# EAGLE schematic MCU_Power_PCB_Rev1 (EAGLE 9.6.2)
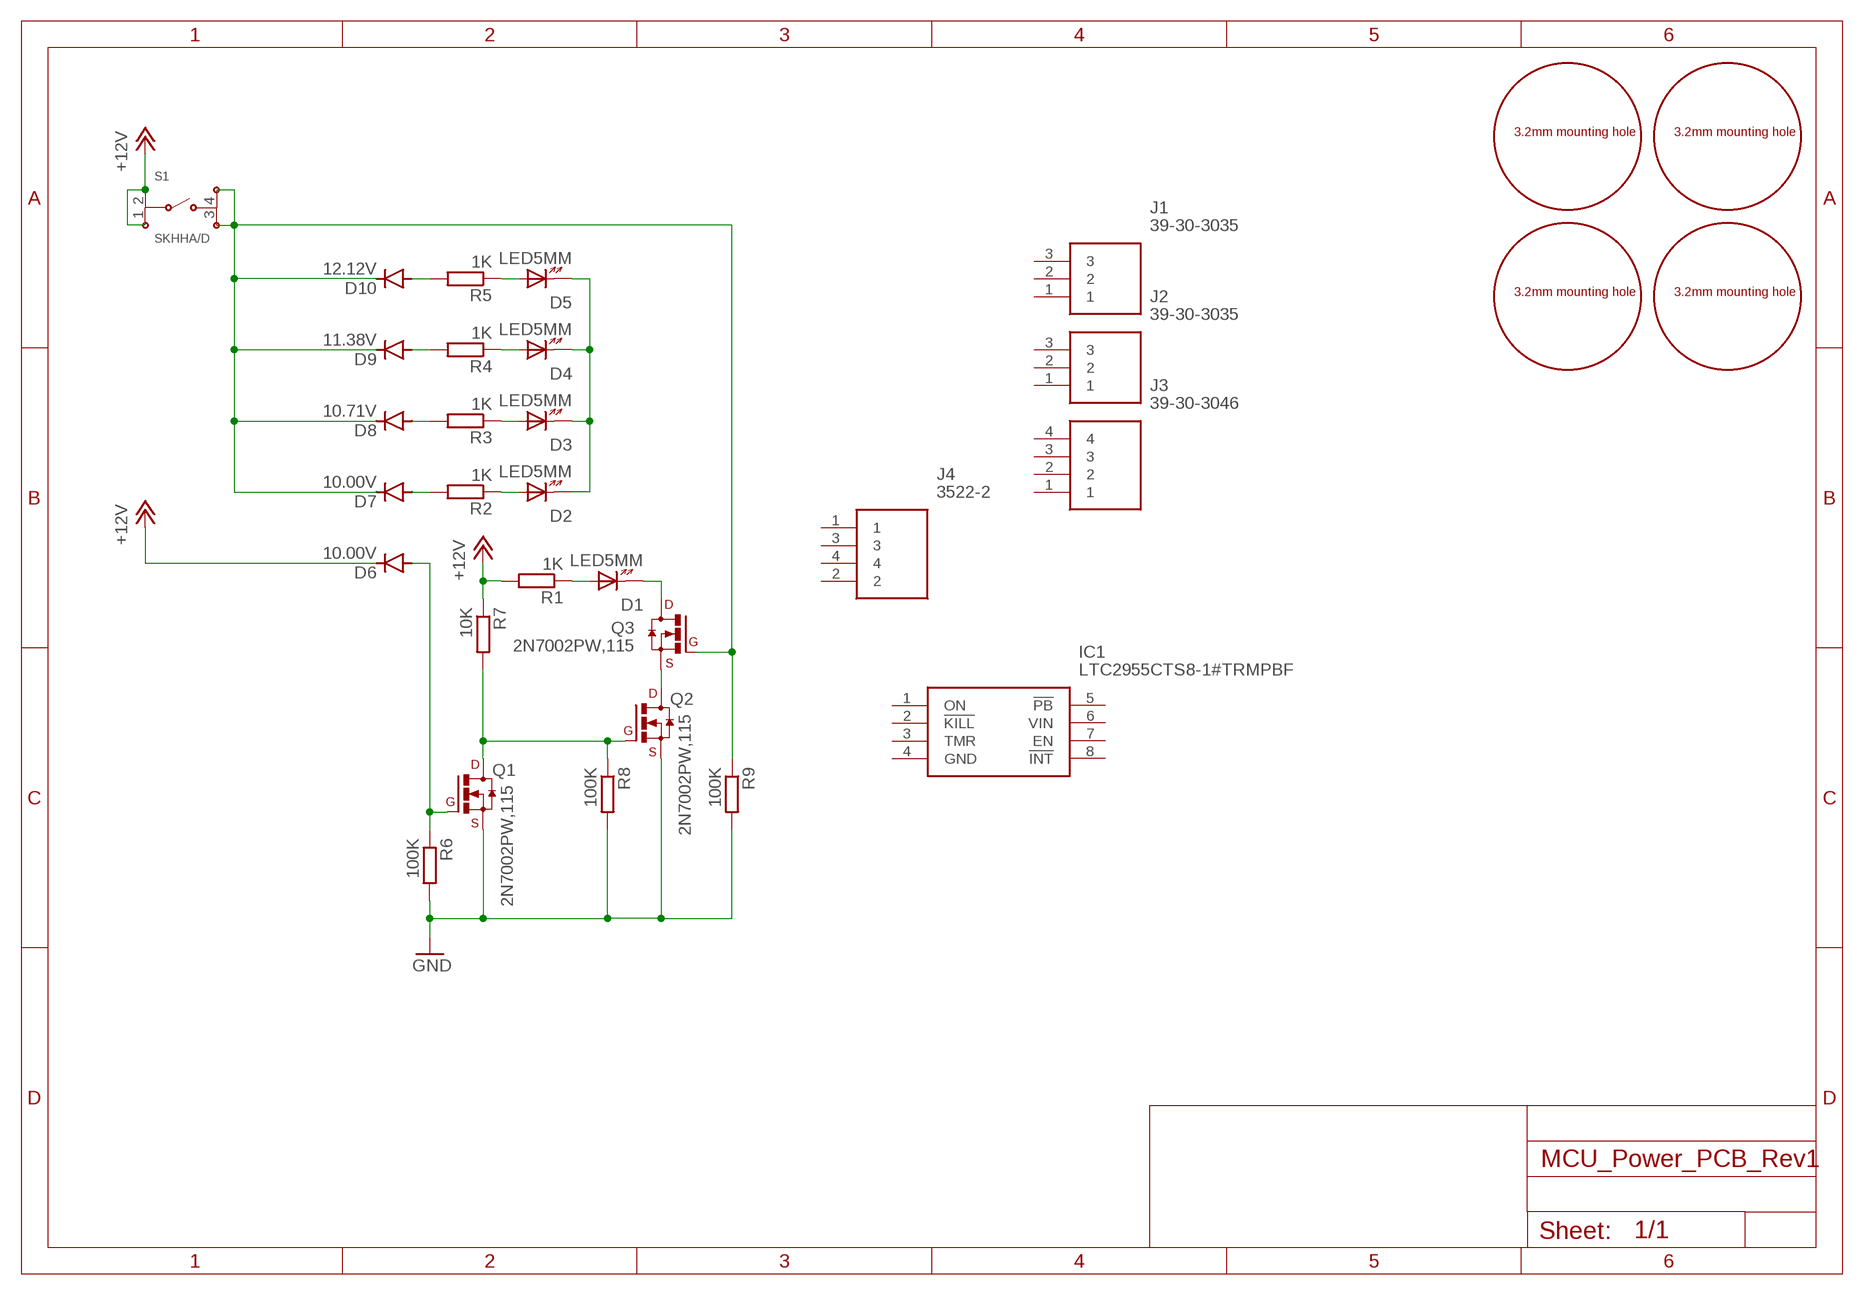
[diagram p0: schematic, sheet 1]

## Parts
D1  LED5MM  [LED5MM]
D2  LED5MM  [LED5MM]
D3  LED5MM  [LED5MM]
D4  LED5MM  [LED5MM]
D5  LED5MM  [LED5MM]
D6  10.00V  CGRM4001-G  [SOD-123_MINI-SMA]
D7  10.00V  CGRM4001-G  [SOD-123_MINI-SMA]
D8  10.71V  CGRM4001-G  [SOD-123_MINI-SMA]
D9  11.38V  CGRM4001-G  [SOD-123_MINI-SMA]
D10  12.12V  CGRM4001-G  [SOD-123_MINI-SMA]
HOLE1  M3_MOUNTING_HOLE  [M3_MOUNTING_HOLE]
HOLE2  M3_MOUNTING_HOLE  [M3_MOUNTING_HOLE]
HOLE3  M3_MOUNTING_HOLE  [M3_MOUNTING_HOLE]
HOLE4  M3_MOUNTING_HOLE  [M3_MOUNTING_HOLE]
IC1  LTC2955CTS8-1#TRMPBF  [SOT65P280X100-8N]
J1  39-30-3035  [39303035]
J2  39-30-3035  [39303035]
J3  39-30-3046  [39303046]
J4  3522-2  [35222]
Q1  2N7002PW,115  [SOT323]
Q2  2N7002PW,115  [SOT323]
Q3  2N7002PW,115  [SOT323]
R1  1K  R0603  [R0603]
R2  1K  R0603  [R0603]
R3  1K  R0603  [R0603]
R4  1K  R0603  [R0603]
R5  1K  R0603  [R0603]
R6  100K  R0603  [R0603]
R7  10K  R0603  [R0603]
R8  100K  R0603  [R0603]
R9  100K  R0603  [R0603]
S1  SKHHA/D  [SKHHA/D]

## Nets
+12V: D6.C R1.2 R7.1 S1.1 S1.2
GND: Q1.2(S) Q2.2(S) R6.2 R8.2 R9.2
N$1: D6.A Q1.1(G) R6.1
N$2: D1.A R1.1
N$3: D2.A R2.1
N$4: D7.A R2.2
N$5: D8.A R3.2
N$6: D9.A R4.2
N$7: D10.A R5.2
N$8: D3.A R3.1
N$9: D4.A R4.1
N$10: D5.A R5.1
N$11: Q1.3(D) Q2.1(G) R7.2 R8.1
N$12: D1.K Q3.3(D)
N$13: D2.K D3.K D4.K D5.K
N$15: Q2.3(D) Q3.2(S)
N$16: D7.C D8.C D9.C D10.C Q3.1(G) R9.1 S1.3 S1.4
Unconnected: IC1.1(ON) IC1.2(!KILL) IC1.3(TMR) IC1.5(!PB) IC1.6(VIN) IC1.7(EN) IC1.8(!INT) J1.1 J1.2 J1.3 J2.1 J2.2 J2.3 J3.1 J3.2 J3.3 J3.4 J4.1 J4.2 J4.3 J4.4

## Power pins joined to a net without a drawn wire
GND: IC1.4(GND)

## Library data of the parts
D1-D5 = CASE-LED:LED5MM: LED 5mm (TH) Description: Standard 5mm TH LED
D6-D10 = diode:CGRM400*-G: Molded plasitc,JEDEC SOD-123/Mini SMA Source: Comchip CGRM4001-G.pdf
HOLE1-HOLE4 = RescueRunner:M3_MOUNTING_HOLE
IC1 = LTC2955CTS8-1#TRMPBF:LTC2955CTS8-1#TRMPBF: LTC2955CTS8-1#TRMPBF, Voltage Controller 0.76V Push Button Controller 8-Pin TSOT-23 Source: Datasheet <http://uk.rs-online.com/web/p/products/8226837P>; DESCRIPTION: LTC2955CTS8-1#TRMPBF, Voltage Controller 0.76V Push Button Controller 8-Pin TSOT-23; HEIGHT: 1mm; MANUFACTURER_NAME: Linear Technology; MANUFACTURER_PART_NUMBER: LTC2955CTS8-1#TRMPBF; RS_PART_NUMBER: 8226837P; RS_PRICE-STOCK: http://uk.rs-online.com/web/p/products/8226837P
J1 J2 = 39-30-3035:39-30-3035: Molex Mini-Fit Jr 5569, 3 Way, 1 Row, Right Angle PCB Header Source: Datasheet <http://uk.rs-online.com/web/p/products/6705849P>; ALLIED_NUMBER: 70266945; DESCRIPTION: Molex Mini-Fit Jr 5569, 3 Way, 1 Row, Right Angle PCB Header; HEIGHT: 5.8mm; MANUFACTURER_NAME: Molex; MANUFACTURER_PART_NUMBER: 39-30-3035; RS_PART_NUMBER: 6705849P; RS_PRICE-STOCK: http://uk.rs-online.com/web/p/products/6705849P
J3 = 39-30-3046:39-30-3046: Molex MINI-FIT JR. Series, Series Number 5569, 4.2mm Pitch 4 Way 1 Row Right Angle PCB Header, Solder Termination, 12A Source: Datasheet <http://uk.rs-online.com/web/p/products/6705859P>; ALLIED_NUMBER: 70374137; DESCRIPTION: Molex MINI-FIT JR. Series, Series Number 5569, 4.2mm Pitch 4 Way 1 Row Right Angle PCB Header, Solder Termination, 12A; HEIGHT: 6.18mm; MANUFACTURER_NAME: Molex; MANUFACTURER_PART_NUMBER: 39-30-3046; RS_PART_NUMBER: 6705859P; RS_PRICE-STOCK: http://uk.rs-online.com/web/p/products/6705859P
J4 = 3522-2:3522-2: Double ATO 257 fuseholder,15A 500Vac Keystone 15A PCB Mount Fuse Holder for 5.2 x 0.64mm Automotive Fuse, 500 V ac Source: Datasheet <http://uk.rs-online.com/web/p/products/1676068>; ALLIED_NUMBER: 70181615; DESCRIPTION: Double ATO 257 fuseholder,15A 500Vac Keystone 15A PCB Mount Fuse Holder for 5.2 x 0.64mm Automotive Fuse, 500 V ac; HEIGHT: 8mm; MANUFACTURER_NAME: Keystone Electronics; MANUFACTURER_PART_NUMBER: 3522-2; RS_PART_NUMBER: 1676068; RS_PRICE-STOCK: http://uk.rs-online.com/web/p/products/1676068
Q1-Q3 = CASE-Transistors:2N7002PW,115: 2N7002PW,115 N-Channel Mosfet (SOT-323) Description: 2N7002PW,115 N-Channel Mosfet in a SOT-323 (SC-70) package Links: 2N7002PW,115 <http://www.farnell.com/datasheets/1760698.pdf?_ga=2.3009012.510093211.1546607516-411290609.1543318711>
R1-R9 = CASE-RCL:R0603: Standard Chip RESISTOR 0603 (1608 Metric) Description: Standard Chip RESISTOR 0603 (1608 Metric)
S1 = CASE-Switches:SKHHA/D: ALPS SKHHA/D Tactile SPST switches (DIP) Description: ALPS SKHHA/D Tactile SPST switches in DIP package. Links: SKHHAJA010 <http://www.farnell.com/datasheets/1685516.pdf?_ga=2.249631877.2071720333.1546461288-1112771566.1525371275> SKHHARA010 <http://www.farnell.com/datasheets/1685516.pdf?_ga=2.249631877.2071720333.1546461288-1112771566.1525371275> SKHHAPA010 <http://www.farnell.com/datasheets/1582298.pdf?_ga=2.236523650.2071720333.1546461288-1112771566.1525371275> SKHHDUA010 <http://www.farnell.com/datasheets/1582310.pdf?_ga=2.236523650.2071720333.1546461288-1112771566.1525371275>